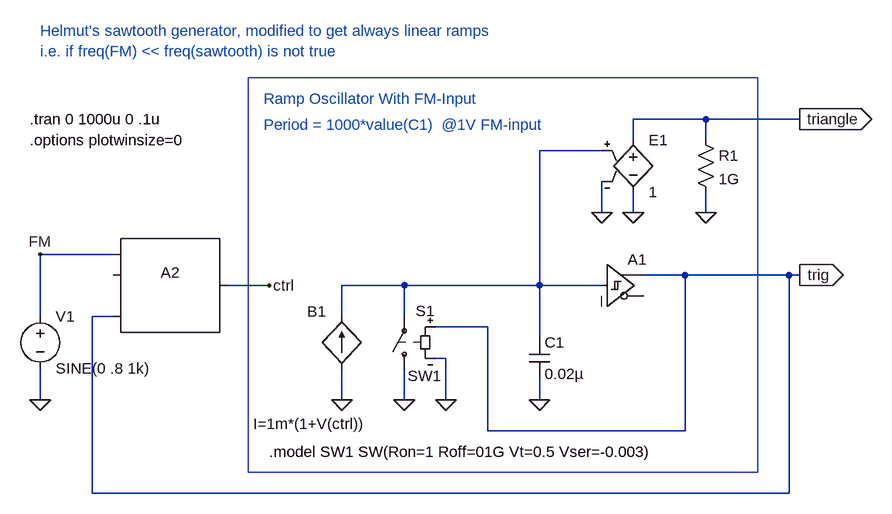
[diagram p0: schematic modulated_sawtooth2b.asc]
modulated_sawtooth2b.asc, the LTspice schematic file:
Version 4
SHEET 1 880 680
WIRE -880 192 -880 96
WIRE -880 320 -880 272
WIRE -800 464 -800 192
WIRE -768 96 -880 96
WIRE -768 192 -800 192
WIRE -528 144 -592 144
WIRE -416 192 -416 144
WIRE -416 320 -416 272
WIRE -320 144 -416 144
WIRE -320 192 -320 144
WIRE -320 320 -320 272
WIRE -256 256 -272 256
WIRE -256 320 -256 256
WIRE -192 208 -272 208
WIRE -192 368 -192 208
WIRE -112 144 -320 144
WIRE -112 144 -112 -64
WIRE -112 224 -112 144
WIRE -112 320 -112 288
WIRE -16 -64 -112 -64
WIRE -16 32 -16 -16
WIRE -16 144 -112 144
WIRE 32 -80 32 -112
WIRE 32 32 32 0
WIRE 112 128 48 128
WIRE 112 368 -192 368
WIRE 112 368 112 128
WIRE 144 -112 32 -112
WIRE 144 -80 144 -112
WIRE 144 32 144 0
WIRE 272 128 112 128
WIRE 272 464 -800 464
WIRE 272 464 272 128
WIRE 288 -112 144 -112
WIRE 288 128 272 128
FLAG -112 320 0
FLAG -880 320 0
FLAG -256 320 0
FLAG -320 320 0
FLAG 288 128 trig
IOPIN 288 128 Out
FLAG -16 32 0
FLAG 32 32 0
FLAG 288 -112 triangle
IOPIN 288 -112 Out
FLAG 144 32 0
FLAG -416 320 0
FLAG -528 144 ctrl
FLAG -880 96 FM
SYMBOL Digital\\schmitt -16 80 R0
SYMATTR InstName A1
SYMATTR Value2 vt=0.5 vh=0.5
SYMATTR SpiceLine td=5n
SYMBOL cap -128 224 R0
SYMATTR InstName C1
SYMATTR Value 0.02µ
SYMBOL voltage -880 176 R0
WINDOW 123 0 0 Left 0
WINDOW 39 0 0 Left 0
SYMATTR InstName V1
SYMATTR Value SINE(0 .8 1k)
SYMBOL sw -320 288 R180
WINDOW 0 -47 105 Left 0
WINDOW 3 -57 5 Left 0
SYMATTR InstName S1
SYMATTR Value SW1
SYMBOL e 32 -96 R0
SYMATTR InstName E1
SYMATTR Value 1
SYMBOL res 128 -96 R0
SYMATTR InstName R1
SYMATTR Value 1G
SYMBOL SpecialFunctions\\sample -688 128 R0
SYMATTR InstName A2
SYMBOL bi -416 272 R180
WINDOW 0 24 88 Left 0
WINDOW 3 -36 -85 Left 0
SYMATTR InstName B1
SYMATTR Value I=1m*(1+V(ctrl))
TEXT -896 -112 Left 0 !.tran 0 1000u 0 .1u
TEXT -896 -80 Left 0 !.options plotwinsize=0
TEXT -528 400 Left 0 !.model SW1 SW(Ron=1 Roff=01G Vt=0.5 Vser=-0.003)
TEXT -536 -144 Left 0 ;Ramp Oscillator With FM-Input
TEXT -536 -104 Left 0 ;Period = 1000*value(C1)  @1V FM-input
TEXT -880 -248 Left 0 ;Helmut's sawtooth generator, modified to get always linear ramps\ni.e. if freq(FM) << freq(sawtooth) is not true
RECTANGLE Normal 224 432 -560 -176

The netlist it stands for:
* modulated_sawtooth2b.asc
A1 N001 0 0 0 0 0 trig 0 SCHMITT vt=0.5 vh=0.5 td=5n
C1 N001 0 0.02µ
V1 FM 0 SINE(0 .8 1k)
S1 0 N001 trig 0 SW1
E1 triangle 0 N001 0 1
R1 triangle 0 1G
A2 FM 0 0 trig 0 0 ctrl 0 SAMPLEHOLD
B1 0 N001 I=1m*(1+V(ctrl))
.tran 0 1000u 0 .1u
.options plotwinsize=0
.model SW1 SW(Ron=1 Roff=01G Vt=0.5 Vser=-0.003)
* Ramp Oscillator With FM-Input
* Period = 1000*value(C1)  @1V FM-input
* Helmut's sawtooth generator, modified to get always linear ramps
* i.e. if freq(FM) << freq(sawtooth) is not true
.backanno
.end